# Altium schematic sheet AFPGA_VME_IO_banks1+3.SchDoc: AFPGA VME & IO
size 420 x 297 mm; CheckedBy: T.Janicki; CompanyName: Creotech Instruments SA; DrawnBy: G.Kasprowicz; Organization: CERN; Address1: European Organization for Nuclear Research; Address2: CH-1211 Geneve 23 - Switzerland; Revision: -; SheetNumber: 7; SheetTotal: 21; EDA_Number: EDA-xxxx; Projet: Simple VME FMC Carrier; ModifiedBy: -; CreateDate: 20/11/2012; CheckedDate: 30/04/2012; Title2: - banks 1 & 3 -; DivGrp: BE-CO; Designer: G.Kasprowicz; PageSetup: Record=PageOptions|CenterHorizontal=True|CenterVertical=True|PrintScale=0.95|XCorrection=1.00|YCorrection=1.00|PrintKind=1|BorderSize=5000000|LeftOffset=0|BottomOffset=0|Orientation=2|PaperLength=1000|PaperWidth=1000|Scale=100|PaperSource=15|PrintQuality=600|MediaType=1|DitherType=10|PaperKind=A3|PrintScaleMode=1; ModifiedDate: -
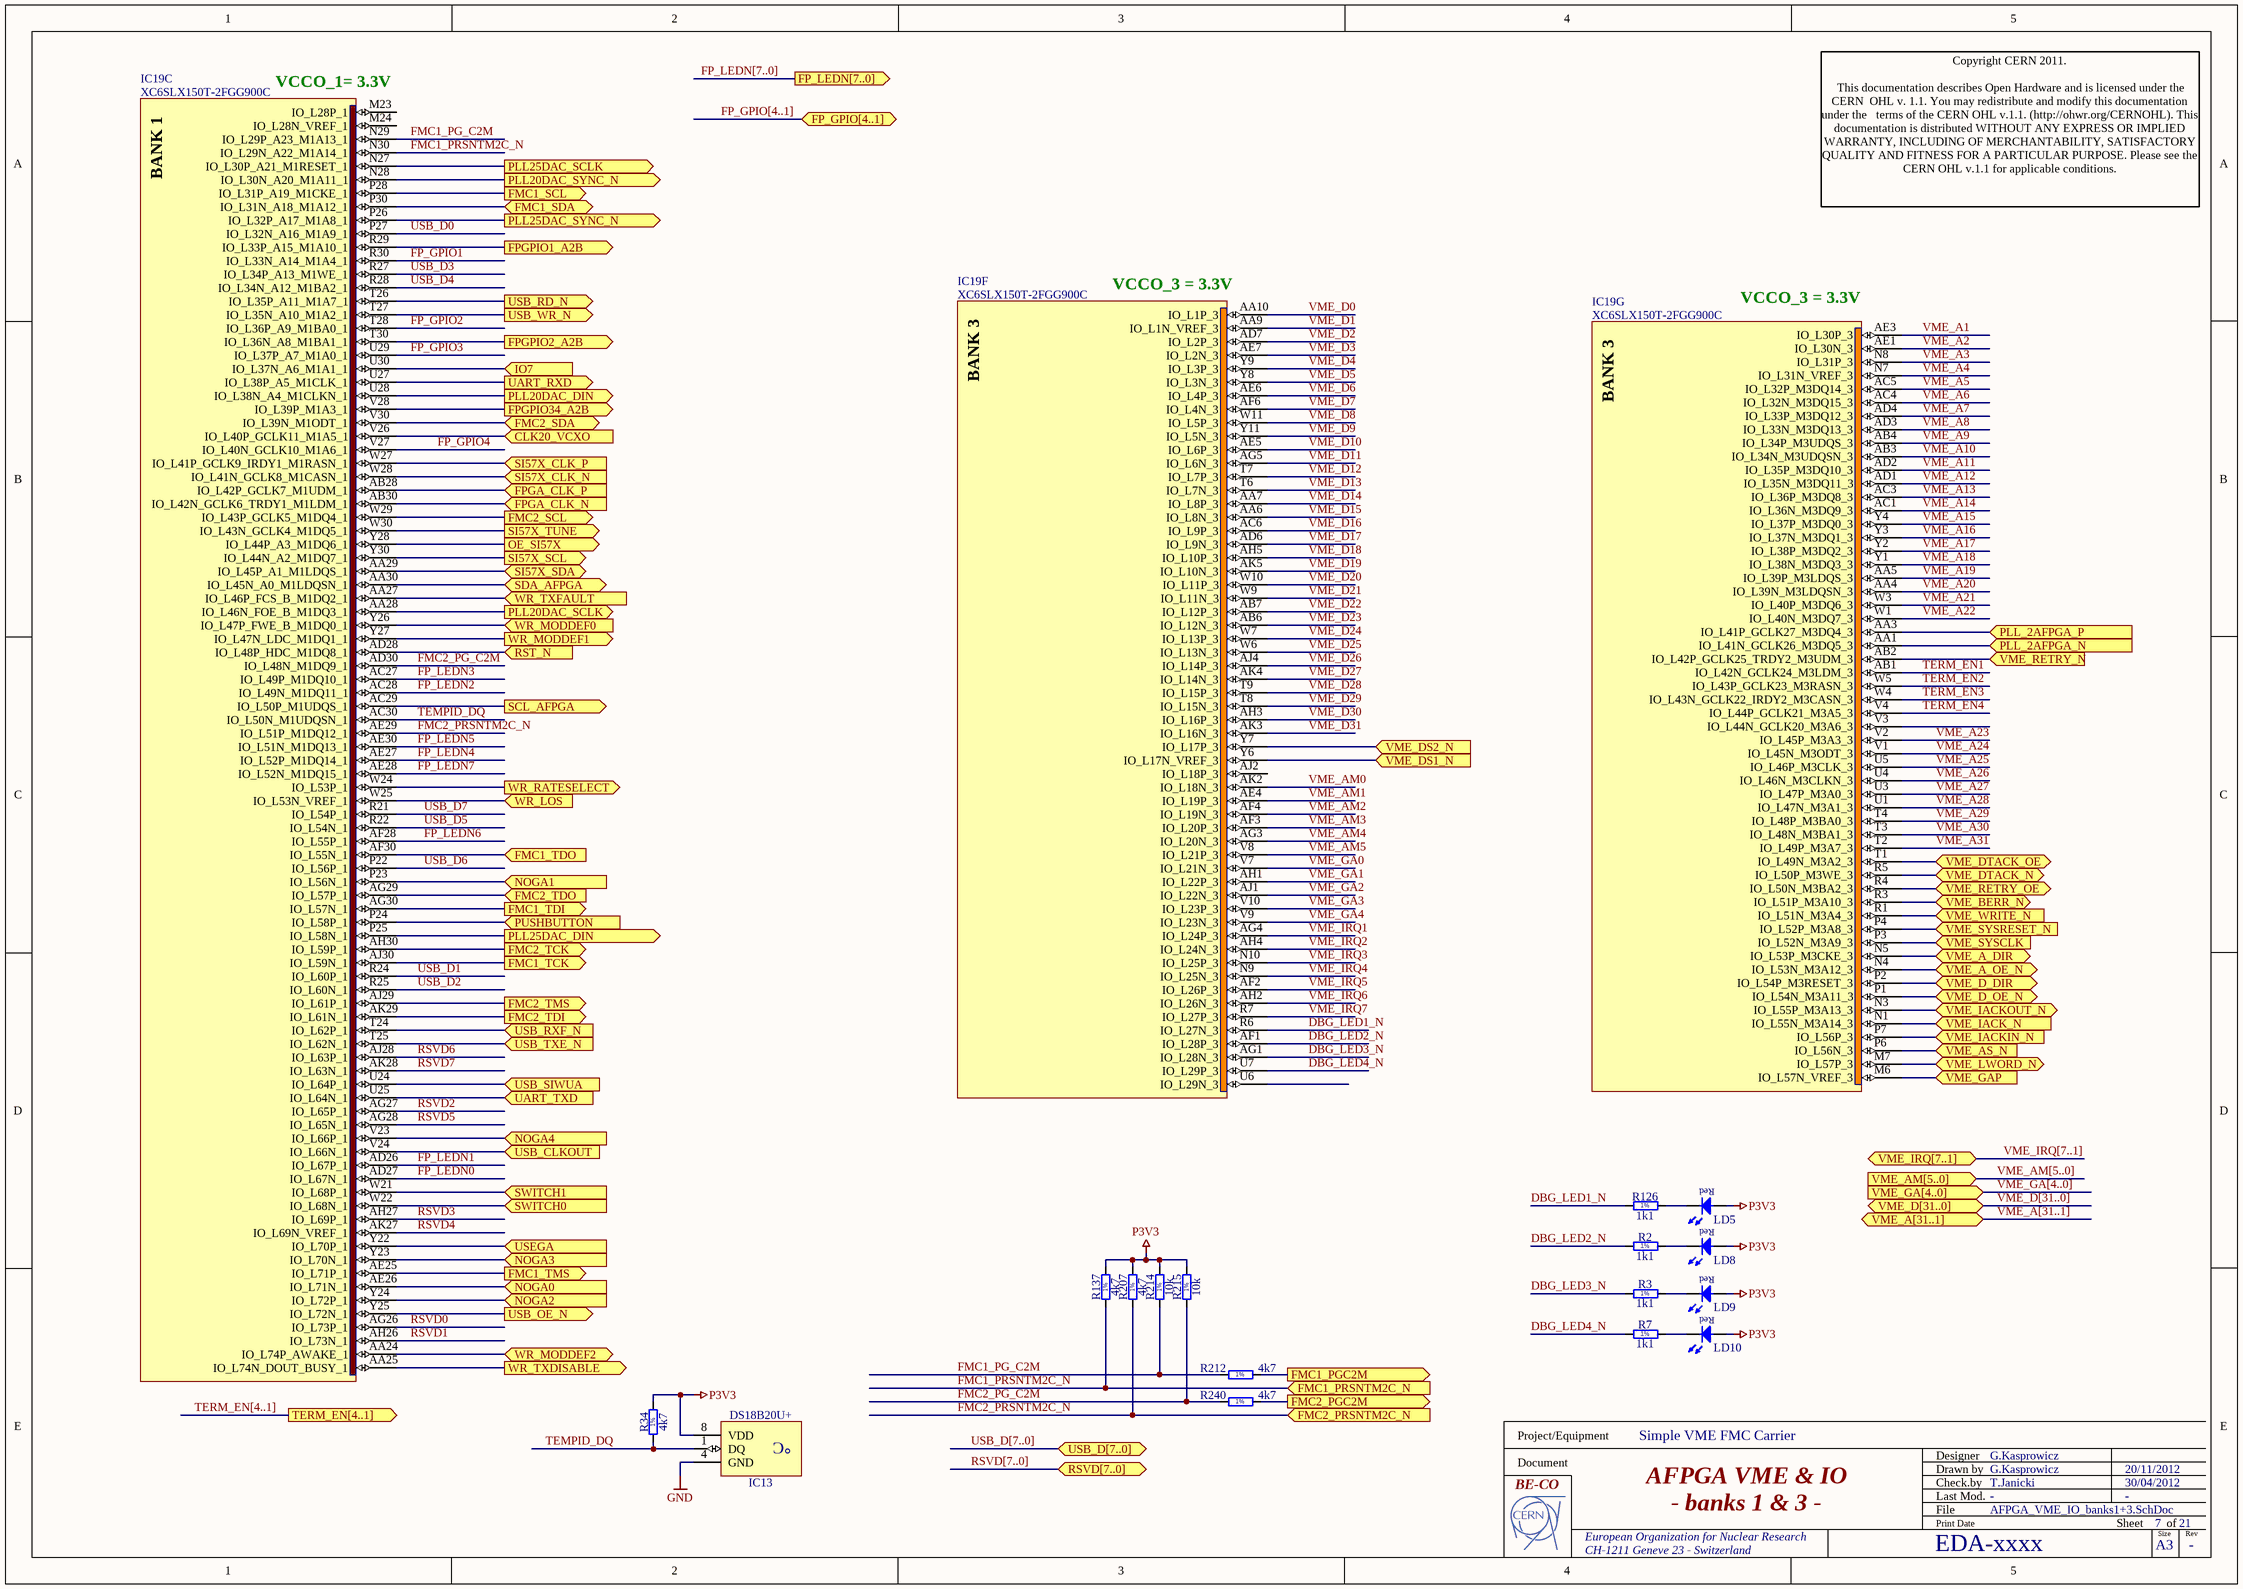
[diagram p0: AFPGA_VME_IO_banks1+3.SchDoc]

## Parts
IC13  DS18B20U+  [SOP65P490X110-8N]
IC19  XC6SLX150T-2FGG900C  [BGA900C100P30X30_3100X3100X260]  (parts C,F,G of 18)
LD5  Red  [LEDC1608X80N_RED]  (value not drawn)
LD8  Red  [LEDC1608X80N_RED]  (value not drawn)
LD9  Red  [LEDC1608X80N_RED]  (value not drawn)
LD10  Red  [LEDC1608X80N_RED]  (value not drawn)
R2  1k1  [RESC1608X55N]
R3  1k1  [RESC1608X55N]
R7  1k1  [RESC1608X55N]
R34  4k7  [RESC1608X55N]
R126  1k1  [RESC1608X55N]
R137  4k7  [RESC1608X55N]
R207  4k7  [RESC1608X55N]
R212  4k7  [RESC1608X55N]
R214  10k  [RESC1608X55N]
R215  10k  [RESC1608X55N]
R240  4k7  [RESC1608X55N]

## Ports
CLK20_VCXO (in), FMC1_PGC2M (out), FMC1_PRSNTM2C_N (in), FMC1_SCL (out), FMC1_SDA (bidir), FMC1_TCK (out), FMC1_TDI (out), FMC1_TDO (in), FMC1_TMS (out), FMC2_PGC2M (out), FMC2_PRSNTM2C_N (in), FMC2_SCL (out), FMC2_SDA (bidir), FMC2_TCK (out), FMC2_TDI (out), FMC2_TDO (in), FMC2_TMS (out), FP_GPIO[4..1] (bidir), FP_LEDN[7..0] (out), FPGA_CLK_N (in), FPGA_CLK_P (in), FPGPIO1_A2B (out), FPGPIO2_A2B (out), FPGPIO34_A2B (out), IO7 (in), NOGA0 (in), NOGA1 (in), NOGA2 (in), NOGA3 (in), NOGA4 (in), OE_SI57X (out), PLL20DAC_DIN (out), PLL20DAC_SCLK (out), PLL20DAC_SYNC_N (out), PLL25DAC_DIN (out), PLL25DAC_SCLK (out), PLL25DAC_SYNC_N (out), PLL_2AFPGA_N (in), PLL_2AFPGA_P (in), PUSHBUTTON (in), RST_N (in), RSVD[7..0] (bidir), SCL_AFPGA (out), SDA_AFPGA (bidir), SI57X_CLK_N (in), SI57X_CLK_P (in), SI57X_SCL (out), SI57X_SDA (bidir), SI57X_TUNE (out), SWITCH0 (in), SWITCH1 (in), TERM_EN[4..1] (out), UART_RXD (out), UART_TXD (in), USB_CLKOUT (in), USB_D[7..0] (bidir), USB_OE_N (out), USB_RD_N (out), USB_RXF_N (in), USB_SIWUA (in), USB_TXE_N (in), USB_WR_N (out), USEGA (in), VME_A[31..1] (bidir), VME_A_DIR (bidir), VME_A_OE_N (bidir), VME_AM[5..0] (in), VME_AS_N (in), VME_BERR_N (bidir), VME_D[31..0] (bidir), VME_D_DIR (bidir), VME_D_OE_N (bidir), VME_DS1_N (in), VME_DS2_N (in), VME_DTACK_N (bidir), VME_DTACK_OE (bidir), VME_GA[4..0] (in), VME_GAP (in), VME_IACK_N (in), VME_IACKIN_N (in), VME_IACKOUT_N (bidir), VME_IRQ[7..1] (bidir), VME_LWORD_N (bidir), VME_RETRY_N (in), VME_RETRY_OE (bidir), VME_SYSCLK (in), VME_SYSRESET_N (in), VME_WRITE_N (in), WR_LOS (in), WR_MODDEF0 (in), WR_MODDEF1 (out), WR_MODDEF2 (bidir), WR_RATESELECT (out), WR_TXDISABLE (out), WR_TXFAULT (in)

## Nets
GND: IC13.4(GND)
P3V3: IC13.8(VDD) LD5.2(A) LD8.2(A) LD9.2(A) LD10.2(A) R34.2 R137.2 R207.2 R214.2 R215.2
CLK20_VCXO: IC19.V26(IO_L40P_GCLK11_M1A5_1) ; port CLK20_VCXO
DBG_LED1_N: IC19.R6(IO_L27N_3) R126.1
DBG_LED2_N: IC19.AF1(IO_L28P_3) R2.1
DBG_LED3_N: IC19.AG1(IO_L28N_3) R3.1
DBG_LED4_N: IC19.U7(IO_L29P_3) R7.1
FMC1_PG_C2M: IC19.N29(IO_L29P_A23_M1A13_1) R212.1 R214.1
FMC1_PGC2M: R212.2 ; port FMC1_PGC2M
FMC1_PRSNTM2C_N: IC19.N30(IO_L29N_A22_M1A14_1) R137.1 ; port FMC1_PRSNTM2C_N
FMC1_SCL: IC19.P28(IO_L31P_A19_M1CKE_1) ; port FMC1_SCL
FMC1_SDA: IC19.P30(IO_L31N_A18_M1A12_1) ; port FMC1_SDA
FMC1_TCK: IC19.AJ30(IO_L59N_1) ; port FMC1_TCK
FMC1_TDI: IC19.AG30(IO_L57N_1) ; port FMC1_TDI
FMC1_TDO: IC19.AF30(IO_L55N_1) ; port FMC1_TDO
FMC1_TMS: IC19.AE25(IO_L71P_1) ; port FMC1_TMS
FMC2_PG_C2M: IC19.AD30(IO_L48N_M1DQ9_1) R215.1 R240.1
FMC2_PGC2M: R240.2 ; port FMC2_PGC2M
FMC2_PRSNTM2C_N: IC19.AE29(IO_L51P_M1DQ12_1) R207.1 ; port FMC2_PRSNTM2C_N
FMC2_SCL: IC19.W29(IO_L43P_GCLK5_M1DQ4_1) ; port FMC2_SCL
FMC2_SDA: IC19.V30(IO_L39N_M1ODT_1) ; port FMC2_SDA
FMC2_TCK: IC19.AH30(IO_L59P_1) ; port FMC2_TCK
FMC2_TDI: IC19.AK29(IO_L61N_1) ; port FMC2_TDI
FMC2_TDO: IC19.AG29(IO_L57P_1) ; port FMC2_TDO
FMC2_TMS: IC19.AJ29(IO_L61P_1) ; port FMC2_TMS
FP_GPIO1: IC19.R30(IO_L33N_A14_M1A4_1)
FP_GPIO2: IC19.T28(IO_L36P_A9_M1BA0_1)
FP_GPIO3: IC19.U29(IO_L37P_A7_M1A0_1)
FP_GPIO4: IC19.V27(IO_L40N_GCLK10_M1A6_1)
FP_LEDN0: IC19.AD27(IO_L67N_1)
FP_LEDN1: IC19.AD26(IO_L67P_1)
FP_LEDN2: IC19.AC28(IO_L49N_M1DQ11_1)
FP_LEDN3: IC19.AC27(IO_L49P_M1DQ10_1)
FP_LEDN4: IC19.AE27(IO_L52P_M1DQ14_1)
FP_LEDN5: IC19.AE30(IO_L51N_M1DQ13_1)
FP_LEDN6: IC19.AF28(IO_L55P_1)
FP_LEDN7: IC19.AE28(IO_L52N_M1DQ15_1)
FPGA_CLK_N: IC19.AB30(IO_L42N_GCLK6_TRDY1_M1LDM_1) ; port FPGA_CLK_N
FPGA_CLK_P: IC19.AB28(IO_L42P_GCLK7_M1UDM_1) ; port FPGA_CLK_P
FPGPIO1_A2B: IC19.R29(IO_L33P_A15_M1A10_1) ; port FPGPIO1_A2B
FPGPIO2_A2B: IC19.T30(IO_L36N_A8_M1BA1_1) ; port FPGPIO2_A2B
FPGPIO34_A2B: IC19.V28(IO_L39P_M1A3_1) ; port FPGPIO34_A2B
IO7: IC19.U30(IO_L37N_A6_M1A1_1) ; port IO7
NOGA0: IC19.AE26(IO_L71N_1) ; port NOGA0
NOGA1: IC19.P23(IO_L56N_1) ; port NOGA1
NOGA2: IC19.Y24(IO_L72P_1) ; port NOGA2
NOGA3: IC19.Y23(IO_L70N_1) ; port NOGA3
NOGA4: IC19.V23(IO_L66P_1) ; port NOGA4
OE_SI57X: IC19.Y28(IO_L44P_A3_M1DQ6_1) ; port OE_SI57X
PLL20DAC_DIN: IC19.U28(IO_L38N_A4_M1CLKN_1) ; port PLL20DAC_DIN
PLL20DAC_SCLK: IC19.AA28(IO_L46N_FOE_B_M1DQ3_1) ; port PLL20DAC_SCLK
PLL20DAC_SYNC_N: IC19.N28(IO_L30N_A20_M1A11_1) ; port PLL20DAC_SYNC_N
PLL25DAC_DIN: IC19.P25(IO_L58N_1) ; port PLL25DAC_DIN
PLL25DAC_SCLK: IC19.N27(IO_L30P_A21_M1RESET_1) ; port PLL25DAC_SCLK
PLL25DAC_SYNC_N: IC19.P26(IO_L32P_A17_M1A8_1) ; port PLL25DAC_SYNC_N
PLL_2AFPGA_N: IC19.AA1(IO_L41N_GCLK26_M3DQ5_3) ; port PLL_2AFPGA_N
PLL_2AFPGA_P: IC19.AA3(IO_L41P_GCLK27_M3DQ4_3) ; port PLL_2AFPGA_P
PUSHBUTTON: IC19.P24(IO_L58P_1) ; port PUSHBUTTON
RST_N: IC19.AD28(IO_L48P_HDC_M1DQ8_1) ; port RST_N
RSVD0: IC19.AG26(IO_L73P_1)
RSVD1: IC19.AH26(IO_L73N_1)
RSVD2: IC19.AG27(IO_L65P_1)
RSVD3: IC19.AH27(IO_L69P_1)
RSVD4: IC19.AK27(IO_L69N_VREF_1)
RSVD5: IC19.AG28(IO_L65N_1)
RSVD6: IC19.AJ28(IO_L63P_1)
RSVD7: IC19.AK28(IO_L63N_1)
SCL_AFPGA: IC19.AC29(IO_L50P_M1UDQS_1) ; port SCL_AFPGA
SDA_AFPGA: IC19.AA30(IO_L45N_A0_M1LDQSN_1) ; port SDA_AFPGA
SI57X_CLK_N: IC19.W28(IO_L41N_GCLK8_M1CASN_1) ; port SI57X_CLK_N
SI57X_CLK_P: IC19.W27(IO_L41P_GCLK9_IRDY1_M1RASN_1) ; port SI57X_CLK_P
SI57X_SCL: IC19.Y30(IO_L44N_A2_M1DQ7_1) ; port SI57X_SCL
SI57X_SDA: IC19.AA29(IO_L45P_A1_M1LDQS_1) ; port SI57X_SDA
SI57X_TUNE: IC19.W30(IO_L43N_GCLK4_M1DQ5_1) ; port SI57X_TUNE
SWITCH0: IC19.W22(IO_L68N_1) ; port SWITCH0
SWITCH1: IC19.W21(IO_L68P_1) ; port SWITCH1
TEMPID_DQ: IC13.1(DQ) IC19.AC30(IO_L50N_M1UDQSN_1) R34.1
TERM_EN1: IC19.AB1(IO_L42N_GCLK24_M3LDM_3)
TERM_EN2: IC19.W5(IO_L43P_GCLK23_M3RASN_3)
TERM_EN3: IC19.W4(IO_L43N_GCLK22_IRDY2_M3CASN_3)
TERM_EN4: IC19.V4(IO_L44P_GCLK21_M3A5_3)
UART_RXD: IC19.U27(IO_L38P_A5_M1CLK_1) ; port UART_RXD
UART_TXD: IC19.U25(IO_L64N_1) ; port UART_TXD
USB_CLKOUT: IC19.V24(IO_L66N_1) ; port USB_CLKOUT
USB_D0: IC19.P27(IO_L32N_A16_M1A9_1)
USB_D1: IC19.R24(IO_L60P_1)
USB_D2: IC19.R25(IO_L60N_1)
USB_D3: IC19.R27(IO_L34P_A13_M1WE_1)
USB_D4: IC19.R28(IO_L34N_A12_M1BA2_1)
USB_D5: IC19.R22(IO_L54N_1)
USB_D6: IC19.P22(IO_L56P_1)
USB_D7: IC19.R21(IO_L54P_1)
USB_OE_N: IC19.Y25(IO_L72N_1) ; port USB_OE_N
USB_RD_N: IC19.T26(IO_L35P_A11_M1A7_1) ; port USB_RD_N
USB_RXF_N: IC19.T24(IO_L62P_1) ; port USB_RXF_N
USB_SIWUA: IC19.U24(IO_L64P_1) ; port USB_SIWUA
USB_TXE_N: IC19.T25(IO_L62N_1) ; port USB_TXE_N
USB_WR_N: IC19.T27(IO_L35N_A10_M1A2_1) ; port USB_WR_N
USEGA: IC19.Y22(IO_L70P_1) ; port USEGA
VME_A1: IC19.AE3(IO_L30P_3)
VME_A2: IC19.AE1(IO_L30N_3)
VME_A3: IC19.N8(IO_L31P_3)
VME_A4: IC19.N7(IO_L31N_VREF_3)
VME_A5: IC19.AC5(IO_L32P_M3DQ14_3)
VME_A6: IC19.AC4(IO_L32N_M3DQ15_3)
VME_A7: IC19.AD4(IO_L33P_M3DQ12_3)
VME_A8: IC19.AD3(IO_L33N_M3DQ13_3)
VME_A9: IC19.AB4(IO_L34P_M3UDQS_3)
VME_A10: IC19.AB3(IO_L34N_M3UDQSN_3)
VME_A11: IC19.AD2(IO_L35P_M3DQ10_3)
VME_A12: IC19.AD1(IO_L35N_M3DQ11_3)
VME_A13: IC19.AC3(IO_L36P_M3DQ8_3)
VME_A14: IC19.AC1(IO_L36N_M3DQ9_3)
VME_A15: IC19.Y4(IO_L37P_M3DQ0_3)
VME_A16: IC19.Y3(IO_L37N_M3DQ1_3)
VME_A17: IC19.Y2(IO_L38P_M3DQ2_3)
VME_A18: IC19.Y1(IO_L38N_M3DQ3_3)
VME_A19: IC19.AA5(IO_L39P_M3LDQS_3)
VME_A20: IC19.AA4(IO_L39N_M3LDQSN_3)
VME_A21: IC19.W3(IO_L40P_M3DQ6_3)
VME_A22: IC19.W1(IO_L40N_M3DQ7_3)
VME_A23: IC19.V2(IO_L45P_M3A3_3)
VME_A24: IC19.V1(IO_L45N_M3ODT_3)
VME_A25: IC19.U5(IO_L46P_M3CLK_3)
VME_A26: IC19.U4(IO_L46N_M3CLKN_3)
VME_A27: IC19.U3(IO_L47P_M3A0_3)
VME_A28: IC19.U1(IO_L47N_M3A1_3)
VME_A29: IC19.T4(IO_L48P_M3BA0_3)
VME_A30: IC19.T3(IO_L48N_M3BA1_3)
VME_A31: IC19.T2(IO_L49P_M3A7_3)
VME_A_DIR: IC19.N5(IO_L53P_M3CKE_3) ; port VME_A_DIR
VME_A_OE_N: IC19.N4(IO_L53N_M3A12_3) ; port VME_A_OE_N
VME_AM0: IC19.AK2(IO_L18N_3)
VME_AM1: IC19.AE4(IO_L19P_3)
VME_AM2: IC19.AF4(IO_L19N_3)
VME_AM3: IC19.AF3(IO_L20P_3)
VME_AM4: IC19.AG3(IO_L20N_3)
VME_AM5: IC19.V8(IO_L21P_3)
VME_AS_N: IC19.P6(IO_L56N_3) ; port VME_AS_N
VME_BERR_N: IC19.R3(IO_L51P_M3A10_3) ; port VME_BERR_N
VME_D0: IC19.AA10(IO_L1P_3)
VME_D1: IC19.AA9(IO_L1N_VREF_3)
VME_D2: IC19.AD7(IO_L2P_3)
VME_D3: IC19.AE7(IO_L2N_3)
VME_D4: IC19.Y9(IO_L3P_3)
VME_D5: IC19.Y8(IO_L3N_3)
VME_D6: IC19.AE6(IO_L4P_3)
VME_D7: IC19.AF6(IO_L4N_3)
VME_D8: IC19.W11(IO_L5P_3)
VME_D9: IC19.Y11(IO_L5N_3)
VME_D10: IC19.AE5(IO_L6P_3)
VME_D11: IC19.AG5(IO_L6N_3)
VME_D12: IC19.T7(IO_L7P_3)
VME_D13: IC19.T6(IO_L7N_3)
VME_D14: IC19.AA7(IO_L8P_3)
VME_D15: IC19.AA6(IO_L8N_3)
VME_D16: IC19.AC6(IO_L9P_3)
VME_D17: IC19.AD6(IO_L9N_3)
VME_D18: IC19.AH5(IO_L10P_3)
VME_D19: IC19.AK5(IO_L10N_3)
VME_D20: IC19.W10(IO_L11P_3)
VME_D21: IC19.W9(IO_L11N_3)
VME_D22: IC19.AB7(IO_L12P_3)
VME_D23: IC19.AB6(IO_L12N_3)
VME_D24: IC19.W7(IO_L13P_3)
VME_D25: IC19.W6(IO_L13N_3)
VME_D26: IC19.AJ4(IO_L14P_3)
VME_D27: IC19.AK4(IO_L14N_3)
VME_D28: IC19.T9(IO_L15P_3)
VME_D29: IC19.T8(IO_L15N_3)
VME_D30: IC19.AH3(IO_L16P_3)
VME_D31: IC19.AK3(IO_L16N_3)
VME_D_DIR: IC19.P2(IO_L54P_M3RESET_3) ; port VME_D_DIR
VME_D_OE_N: IC19.P1(IO_L54N_M3A11_3) ; port VME_D_OE_N
VME_DS1_N: IC19.Y6(IO_L17N_VREF_3) ; port VME_DS1_N
VME_DS2_N: IC19.Y7(IO_L17P_3) ; port VME_DS2_N
VME_DTACK_N: IC19.R5(IO_L50P_M3WE_3) ; port VME_DTACK_N
VME_DTACK_OE: IC19.T1(IO_L49N_M3A2_3) ; port VME_DTACK_OE
VME_GA0: IC19.V7(IO_L21N_3)
VME_GA1: IC19.AH1(IO_L22P_3)
VME_GA2: IC19.AJ1(IO_L22N_3)
VME_GA3: IC19.V10(IO_L23P_3)
VME_GA4: IC19.V9(IO_L23N_3)
VME_GAP: IC19.M6(IO_L57N_VREF_3) ; port VME_GAP
VME_IACK_N: IC19.N1(IO_L55N_M3A14_3) ; port VME_IACK_N
VME_IACKIN_N: IC19.P7(IO_L56P_3) ; port VME_IACKIN_N
VME_IACKOUT_N: IC19.N3(IO_L55P_M3A13_3) ; port VME_IACKOUT_N
VME_IRQ1: IC19.AG4(IO_L24P_3)
VME_IRQ2: IC19.AH4(IO_L24N_3)
VME_IRQ3: IC19.N10(IO_L25P_3)
VME_IRQ4: IC19.N9(IO_L25N_3)
VME_IRQ5: IC19.AF2(IO_L26P_3)
VME_IRQ6: IC19.AH2(IO_L26N_3)
VME_IRQ7: IC19.R7(IO_L27P_3)
VME_LWORD_N: IC19.M7(IO_L57P_3) ; port VME_LWORD_N
VME_RETRY_N: IC19.AB2(IO_L42P_GCLK25_TRDY2_M3UDM_3) ; port VME_RETRY_N
VME_RETRY_OE: IC19.R4(IO_L50N_M3BA2_3) ; port VME_RETRY_OE
VME_SYSCLK: IC19.P3(IO_L52N_M3A9_3) ; port VME_SYSCLK
VME_SYSRESET_N: IC19.P4(IO_L52P_M3A8_3) ; port VME_SYSRESET_N
VME_WRITE_N: IC19.R1(IO_L51N_M3A4_3) ; port VME_WRITE_N
WR_LOS: IC19.W25(IO_L53N_VREF_1) ; port WR_LOS
WR_MODDEF0: IC19.Y26(IO_L47P_FWE_B_M1DQ0_1) ; port WR_MODDEF0
WR_MODDEF1: IC19.Y27(IO_L47N_LDC_M1DQ1_1) ; port WR_MODDEF1
WR_MODDEF2: IC19.AA24(IO_L74P_AWAKE_1) ; port WR_MODDEF2
WR_RATESELECT: IC19.W24(IO_L53P_1) ; port WR_RATESELECT
WR_TXDISABLE: IC19.AA25(IO_L74N_DOUT_BUSY_1) ; port WR_TXDISABLE
WR_TXFAULT: IC19.AA27(IO_L46P_FCS_B_M1DQ2_1) ; port WR_TXFAULT
NetLD5_1: LD5.1(C) R126.2
NetLD8_1: LD8.1(C) R2.2
NetLD9_1: LD9.1(C) R3.2
NetLD10_1: LD10.1(C) R7.2

Not connected (* = marked no-connect by the designer): IC19 AJ2(IO_L18P_3) M23(IO_L28P_1) M24(IO_L28N_VREF_1) U6(IO_L29N_3) V3(IO_L44N_GCLK20_M3A6_3)

## Buses and harness runs
bus FP_GPIO[4..1] = port FP_GPIO[4..1]
bus FP_LEDN[7..0] = port FP_LEDN[7..0]
bus RSVD[7..0] = port RSVD[7..0]
bus TERM_EN[4..1] = port TERM_EN[4..1]
bus USB_D[7..0] = port USB_D[7..0]
bus VME_A[31..1] = port VME_A[31..1]
bus VME_AM[5..0] = port VME_AM[5..0]
bus VME_D[31..0] = port VME_D[31..0]
bus VME_GA[4..0] = port VME_GA[4..0]
bus VME_IRQ[7..1] = port VME_IRQ[7..1]

## Notes on the sheet
- (near IC19) VCCO_1= 3.3V
- Copyright CERN 2011.
  This documentation describes Open Hardware and is licensed under the CERN  OHL v. 1.1. You may redistribute and modify this documentation under the   terms of the CERN OHL v.1.1. (http://ohwr.org/CERNOHL). This  documentation is distributed WITHOUT ANY EXPRESS OR IMPLIED  WARRANTY, INCLUDING OF MERCHANTABILITY, SATISFACTORY  QUALITY AND FITNESS FOR A PARTICULAR PURPOSE. Please see the  CERN OHL v.1.1 for applicable conditions.
- (near IC19) VCCO_3 = 3.3V
- Project/Equipment
- Document
- Designer
- Drawn by
- Check.by
- File
- Last Mod.
- Print Date
- Sheet
- Size
- A3
- of
- Rev
- (in symbol DS18B20U+) °C
- (in symbol R0603_1K1_1%_0.1W_100PPM) 1%
- (in symbol R0603_4K7_1%_0.1W_100PPM) 1%
- (in symbol R0603_10K_1%_0.1W_100PPM) 1%
- (in symbol XC6SLX150T-2FGG900C, part C) BANK 1
- (in symbol XC6SLX150T-2FGG900C, part F) BANK 3
- (in symbol XC6SLX150T-2FGG900C, part G) BANK 3

## Library data of the parts
IC13 = DS18B20U+: Programmable Resolution 1-Wire Digital Thermometer; Part Description: Programmable Resolution 1-Wire Digital Thermometer (-55°C to +125°C); Manufacturer: DALLAS MAXIM; Table: Sensors; Part Number: DS18B20U+; Component Kind: Standard; Component Type: Standard; Device: DS18B20U+; PackageDescription: SOP, 0.65mm pitch; 8 pin, 3.00mm W X 3.00mm L X 1.10mm H body, IPC Medium Density; Manufacturer Part Number: DS18B20U+; Pin Count: 3; Case: uSOP8; Mounted: Yes; Socket: No; SMD: Yes; ComponentHeight: 1.1mm; HelpURL: \\cern.ch\dfs\Applications\Altium\Datasheets\DS18B20U+.pdf; Author: CERN DEM JLC; CreateDate: 3/17/2010; LatestRevisionDate: 3/17/2010
IC19 = XC6SLX150T-2FGG900C: SPARTAN-6, FPGA, 900-Ball BGA, Commercial Grade, Pb-Free; Part Description: SPARTAN-6, FPGA, 540 User I/Os, 8 GTPs, 900-Ball BGA, Commercial Grade, Pb-Free; Manufacturer: XILINX; Table: Logic; Part Number: XC6SLX150T-2FGG900C; Component Kind: Standard; Component Type: Standard; Device: XC6SLX150T-2FGG900C; PackageDescription: BGA,1.00mm pitch, square; 900 pin, 30 columns X 30 rows, 31.00mm X 31.00mm X 2.60mm H, IPC Medium Density; Manufacturer Part Number: XC6SLX150T-2FGG900C; Pin Count: 900; Case: BGA900; Mounted: Yes; Socket: No; SMD: Yes; ComponentHeight: 2.6mm; HelpURL: \\cern.ch\dfs\Applications\Altium\Datasheets\XC6SLX150T-2FGG900C.pdf; ComponentLink1URL: \\cern.ch\dfs\Applications\Altium\Datasheets\XC6SLX150T-2FGG900C_Package-Pinouts.pdf; ComponentLink1Description: Package/Pinouts; Author: CERN DEM JLC; CreateDate: 2009-11-17; LatestRevisionDate: 2009-11-17
LD5 LD8-LD10 = LED_ROHM_SML-311UTT86K: LED Red 1C 2A; Part Description: Low current chip LED SML-311 Serie; Manufacturer: ROHM; Table: LEDs & Displays; Part Number: LED_ROHM_SML-311UTT86K; Component Kind: Standard; Component Type: Standard; Color: Red; PackageDescription: Chip RED LED, 2-Leads, Body 1.6x0.8mm, IPC Medium Density; Manufacturer Part Number: SML-311UTT86K; Pin Count: 2; Mounted: Yes; Socket: No; SMD: Yes; ComponentHeight: 0.8mm; HelpURL: \\cern.ch\dfs\Applications\Altium\Datasheets\LED_ROHM_SML-311UTT86K.pdf; Author: CERN DEM JLC; CreateDate: 3/16/2010; LatestRevisionDate: 3/17/2010
R2 R3 R7 R126 = R0603_1K1_1%_0.1W_100PPM: Resistor - 1%; Part Description: General Purpose Thick Film Chip Resistor; Manufacturer: GENERIC; Manufacturer1 Part Number: NRC06F1101TRF; Power: 0.1W; TC: ±100ppm/°C; Table: Resistors SMD; Part Number: R0603_1K1_1%_0.1W_100PPM; Component Kind: Standard; Component Type: Standard; Pin Count: 2; Value: 1k1; Status: Preferred; Tolerance: ±1%; Manufacturer Part Number: R0603_1K1_1%_0.1W_100PPM; Case: 0603; Mounted: Yes; Socket: No; SMD: Yes; Manufacturer1 Example: NIC COMPONENT; Manufacturer1 ComponentHeight: 0.55mm; HelpURL: \\cern.ch\dfs\Applications\Altium\Datasheets\R0603_NIC_NRC.pdf; Author: CERN DEM JLC; CreateDate: 2007-12-03; LatestRevisionDate: 2008-03-13
R34 R137 R207 R212 R240 = R0603_4K7_1%_0.1W_100PPM: Resistor - 1%; Part Description: General Purpose Thick Film Chip Resistor; Manufacturer: GENERIC; Manufacturer1 Part Number: NRC06F4701TRF; Power: 0.1W; TC: ±100ppm/°C; Table: Resistors SMD; Part Number: R0603_4K7_1%_0.1W_100PPM; Component Kind: Standard; Component Type: Standard; Pin Count: 2; Value: 4k7; Status: Preferred; Tolerance: ±1%; Manufacturer Part Number: R0603_4K7_1%_0.1W_100PPM; Case: 0603; Mounted: Yes; Socket: No; SMD: Yes; Manufacturer1 Example: NIC COMPONENT; Manufacturer1 ComponentHeight: 0.55mm; HelpURL: \\cern.ch\dfs\Applications\Altium\Datasheets\R0603_NIC_NRC.pdf; Author: CERN DEM JLC
  R34 R212 R240: CreateDate: 03/12/2007; LatestRevisionDate: 13/03/2008
  R137 R207: CreateDate: 2007-12-03; LatestRevisionDate: 2008-03-13
R214 R215 = R0603_10K_1%_0.1W_100PPM: Resistor - 1%; Part Description: General Purpose Thick Film Chip Resistor; Manufacturer: GENERIC; Manufacturer1 Part Number: NRC06F1002TRF; Power: 0.1W; TC: ±100ppm/°C; Table: Resistors SMD; Part Number: R0603_10K_1%_0.1W_100PPM; Component Kind: Standard; Component Type: Standard; Pin Count: 2; Value: 10k; Status: Preferred; Tolerance: ±1%; Manufacturer Part Number: R0603_10K_1%_0.1W_100PPM; Case: 0603; Mounted: Yes; Socket: No; SMD: Yes; Manufacturer1 Example: NIC COMPONENT; Manufacturer1 ComponentHeight: 0.55mm; HelpURL: \\cern.ch\dfs\Applications\Altium\Datasheets\R0603_NIC_NRC.pdf; Author: CERN DEM JLC; CreateDate: 2007-12-03; LatestRevisionDate: 2008-03-13